# EAGLE design 5v-switch-sensor (EAGLE 7.2.0)
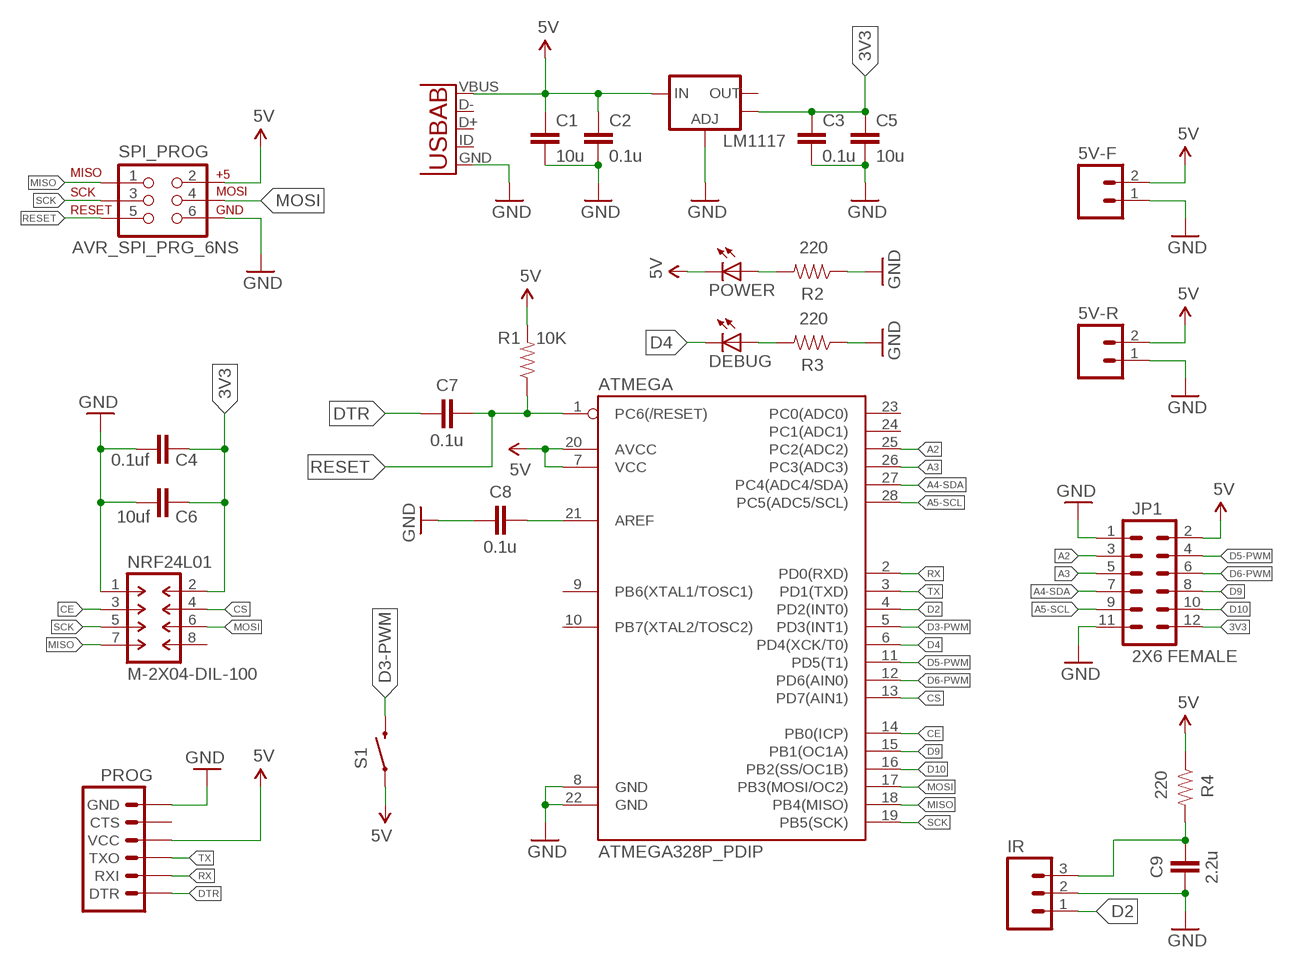
[diagram p0: schematic, sheet 1]

## Parts
5V-F  M02PTH  [1X02]
5V-R  M02PTH  [1X02]
ATMEGA  ATMEGA328P_PDIP  [DIL28-3]
C1  10u  CAP0805  [0805]
C2  0.1u  CAP0805  [0805]
C3  0.1u  CAP0805  [0805]
C4  0.1uf  CAP0805  [0805]
C5  10u  CAP0805  [0805]
C6  10uf  CAP0805  [0805]
C7  0.1u  CAP0805  [0805]
C8  0.1u  CAP0805  [0805]
C9  2.2u  CAP0805  [0805]
DEBUG  LEDCHIPLED_0805  [CHIPLED_0805]
IR  M03PTH  [1X03]
JP1  2X6 FEMALE  M06X2PTH_FEMALE  [2X6]
LM1117  V_REG_LM1117SOT223  [SOT223]
NRF24L01  M-2X04-DIL-100  [DIL-100-2X04]
POWER  LEDCHIPLED_0805  [CHIPLED_0805]
PROG  ARDUINO_SERIAL_PROGRAMPTH  [1X06]
R1  10K  RESISTOR0805-RES  [0805]
R2  220  RESISTOR0805-RES  [0805]
R3  220  RESISTOR0805-RES  [0805]
R4  220  RESISTOR0805-RES  [0805]
S1  SWITCH-MOMENTARY-2SMD-1101NE  [TACTILE-SWITCH-1101NE]
SPI_PROG  AVR_SPI_PRG_6NS  [2X3-NS]
U1  USB-AB  [USB-AB-MICRO-SMD]

## Nets
3V3: C3.1 C4.1 C5.1 C6.1 JP1.12 LM1117.4(OUT) NRF24L01.2
5V: 5V-F.2 5V-R.2 ATMEGA.7(VCC) ATMEGA.20(AVCC) C1.1 C2.1 JP1.2 LM1117.3(IN) POWER.C PROG.4(VCC) R1.2 R4.1 S1.1 SPI_PROG.2 U1.VBUS
A2: ATMEGA.25(PC2(ADC2)) JP1.3
A3: ATMEGA.26(PC3(ADC3)) JP1.5
A4-SDA: ATMEGA.27(PC4(ADC4/SDA)) JP1.7
A5-SCL: ATMEGA.28(PC5(ADC5/SCL)) JP1.9
CE: ATMEGA.14(PB0(ICP)) NRF24L01.3
CS: ATMEGA.13(PD7(AIN1)) NRF24L01.4
D2: ATMEGA.4(PD2(INT0)) IR.1
D3-PWM: ATMEGA.5(PD3(INT1)) S1.2
D4: ATMEGA.6(PD4(XCK/T0)) DEBUG.C
D5-PWM: ATMEGA.11(PD5(T1)) JP1.4
D6-PWM: ATMEGA.12(PD6(AIN0)) JP1.6
D9: ATMEGA.15(PB1(OC1A)) JP1.8
D10: ATMEGA.16(PB2(SS/OC1B)) JP1.10
DTR: C7.1 PROG.1(DTR)
GND: 5V-F.1 5V-R.1 ATMEGA.8(GND) ATMEGA.22(GND) C1.2 C2.2 C3.2 C4.2 C5.2 C6.2 C8.1 C9.1 IR.2 JP1.1 JP1.11 LM1117.1(ADJ) NRF24L01.1 PROG.6(GND) R2.1 R3.1 SPI_PROG.6 U1.GND
MISO: ATMEGA.18(PB4(MISO)) NRF24L01.7 SPI_PROG.1
MOSI: ATMEGA.17(PB3(MOSI/OC2)) NRF24L01.6 SPI_PROG.4
N$1: C9.2 IR.3 R4.2
N$2: POWER.A R2.2
N$3: ATMEGA.21(AREF) C8.2
N$4: DEBUG.A R3.2
RESET: ATMEGA.1(PC6(/RESET)) C7.2 R1.1 SPI_PROG.5
RX: ATMEGA.2(PD0(RXD)) PROG.2(RXI)
SCK: ATMEGA.19(PB5(SCK)) NRF24L01.5 SPI_PROG.3
TX: ATMEGA.3(PD1(TXD)) PROG.3(TXO)
Unconnected: ATMEGA.9(PB6(XTAL1/TOSC1)) ATMEGA.10(PB7(XTAL2/TOSC2)) ATMEGA.23(PC0(ADC0)) ATMEGA.24(PC1(ADC1)) LM1117.2(OUT) NRF24L01.8 PROG.5(CTS) U1.D+ U1.D- U1.ID(USBID)

## Library data of the parts
5V-F 5V-R = SparkFun-Connectors:M02: Standard 2-pin 0.1" header. Use with - straight break away headers ( PRT-00116) - right angle break away headers (PRT-00553) - swiss pins (PRT-00743) - machine pins (PRT-00117) - female headers (PRT-00115) Molex polarized connector foot print use with: PRT-08233 with associated crimp pins and housings. 2.54_SCREWTERM for use with PRT-10571. 3.5mm Screw Terminal footprints for PRT-08084 5mm Screw Terminal footprints for use with PRT-08432
ATMEGA = SparkFun-DigitalIC:ATMEGA328P_PDIP: uC used in the Arduino 32kb flash, 1k EEPROM, 2k SRAM This is the through-hole version of this chip.
C1-C9 = SparkFun-Capacitors:CAP: Capacitor Standard 0603 ceramic capacitor, and 0.1" leaded capacitor.
DEBUG POWER = adafruit:LED: LED OSRAM: - CHIPLED LG R971, LG N971, LY N971, LG Q971, LY Q971, LO R971, LY R971 LH N974, LH R974 LS Q976, LO Q976, LY Q976 LO Q996 - Hyper CHIPLED LW Q18S LB Q993, LB Q99A, LB R99A - SideLED LS A670, LO A670, LY A670, LG A670, LP A670 LB A673, LV A673, LT A673, LW A673 LH A674 LY A675 LS A676, LA A676, LO A676, LY A676, LW A676 LS A679, LY A679, LG A679 - Hyper Micro SIDELED® LS Y876, LA Y876, LO Y876, LY Y876 LT Y87S - SmartLED LW L88C, LW L88S LB L89C, LB L89S, LG L890 LS L89K, LO L89K, LY L89K LS L896, LA L896, LO L896, LY L896 - TOPLED LS T670, LO T670, LY T670, LG T670, LP T670 LSG T670, LSP T670, LSY T670, LOP T670, LYG T670 LG T671, LOG T671, LSG T671 LB T673, LV T673, LT T673, LW T673 LH T674 LS T676, LA T676, LO T676, LY T676, LB T676, LH T676, LSB T676, LW T676 LB T67C, LV T67C, LT T67C, LS T67K, LO T67K, LY T67K, LW E67C LS E67B, LA E67B, LO E67B, LY E67B, LB E67C, LV E67C, LT E67C LW T67C LS T679, LY T679, LG T679 LS T770, LO T770, LY T770, LG T770, LP T770 LB T773, LV T773, LT T773, LW T773 LH T774 LS E675, LA E675, LY E675, LS T675 LS T776, LA T776, LO T776, LY T776, LB T776 LHGB T686 LT T68C, LB T68C - Hyper Mini TOPLED® LB M676 - Mini TOPLED Santana® LG M470 LS M47K, LO M47K, LY M47K Source: http://www.osram.convergy.de/
IR = SparkFun-Connectors:M03: Header 3 Standard 3-pin 0.1" header. Use with straight break away headers (SKU : PRT-00116), right angle break away headers (PRT-00553), swiss pins (PRT-00743), machine pins (PRT-00117), and female headers (PRT-00115). Molex polarized connector foot print use with SKU : PRT-08232 with associated crimp pins and housings.
JP1 = SparkFun-Connectors:M06X2; PROD_ID: CONN-12423
LM1117 = SparkFun-PowerIC:V_REG_LM1117: Voltage Regulator LM1117 Standard adjustable voltage regulator but in SMD form. Spark Fun Electronics SKU : COM-00595; PROD_ID: VREG-08170
NRF24L01 = con-headers-jp:M-2X04-: MALE HEADER
PROG = SparkFun-Connectors:ARDUINO_SERIAL_PROGRAM: FTDI connector footprints
R1-R4 = SparkFun-Resistors:RESISTOR: Resistor Basic schematic elements and footprints for 0603, 1206, and PTH resistors.
S1 = SparkFun-Electromechanical:SWITCH-MOMENTARY-2: Various NO switches- pushbuttons, reed, etc; PROD_ID: SWCH-00815
SPI_PROG = SparkFun-Connectors:AVR_SPI_PRG_6: AVR ISP 6 Pin This is the reduced ISP connector for AVR programming. Common on Arduino. This footprint will take up less PCB space and can be used with a 10-pin to 6-pin adapter such as SKU: BOB-08508 **Special note about "TEST_POINT" package. The stop mask is on the top side, so if you want your programming test points to be on the bottom of your board, make sure to place this package on the bottom side of the board. This also ensure that the orientation to program from the bottom side will be correct.
U1 = SparkFun-Connectors:USB-AB: This is a USB AB connector that is compatible with USB OTG. i.e. this connector can serve as a host or device

## Board
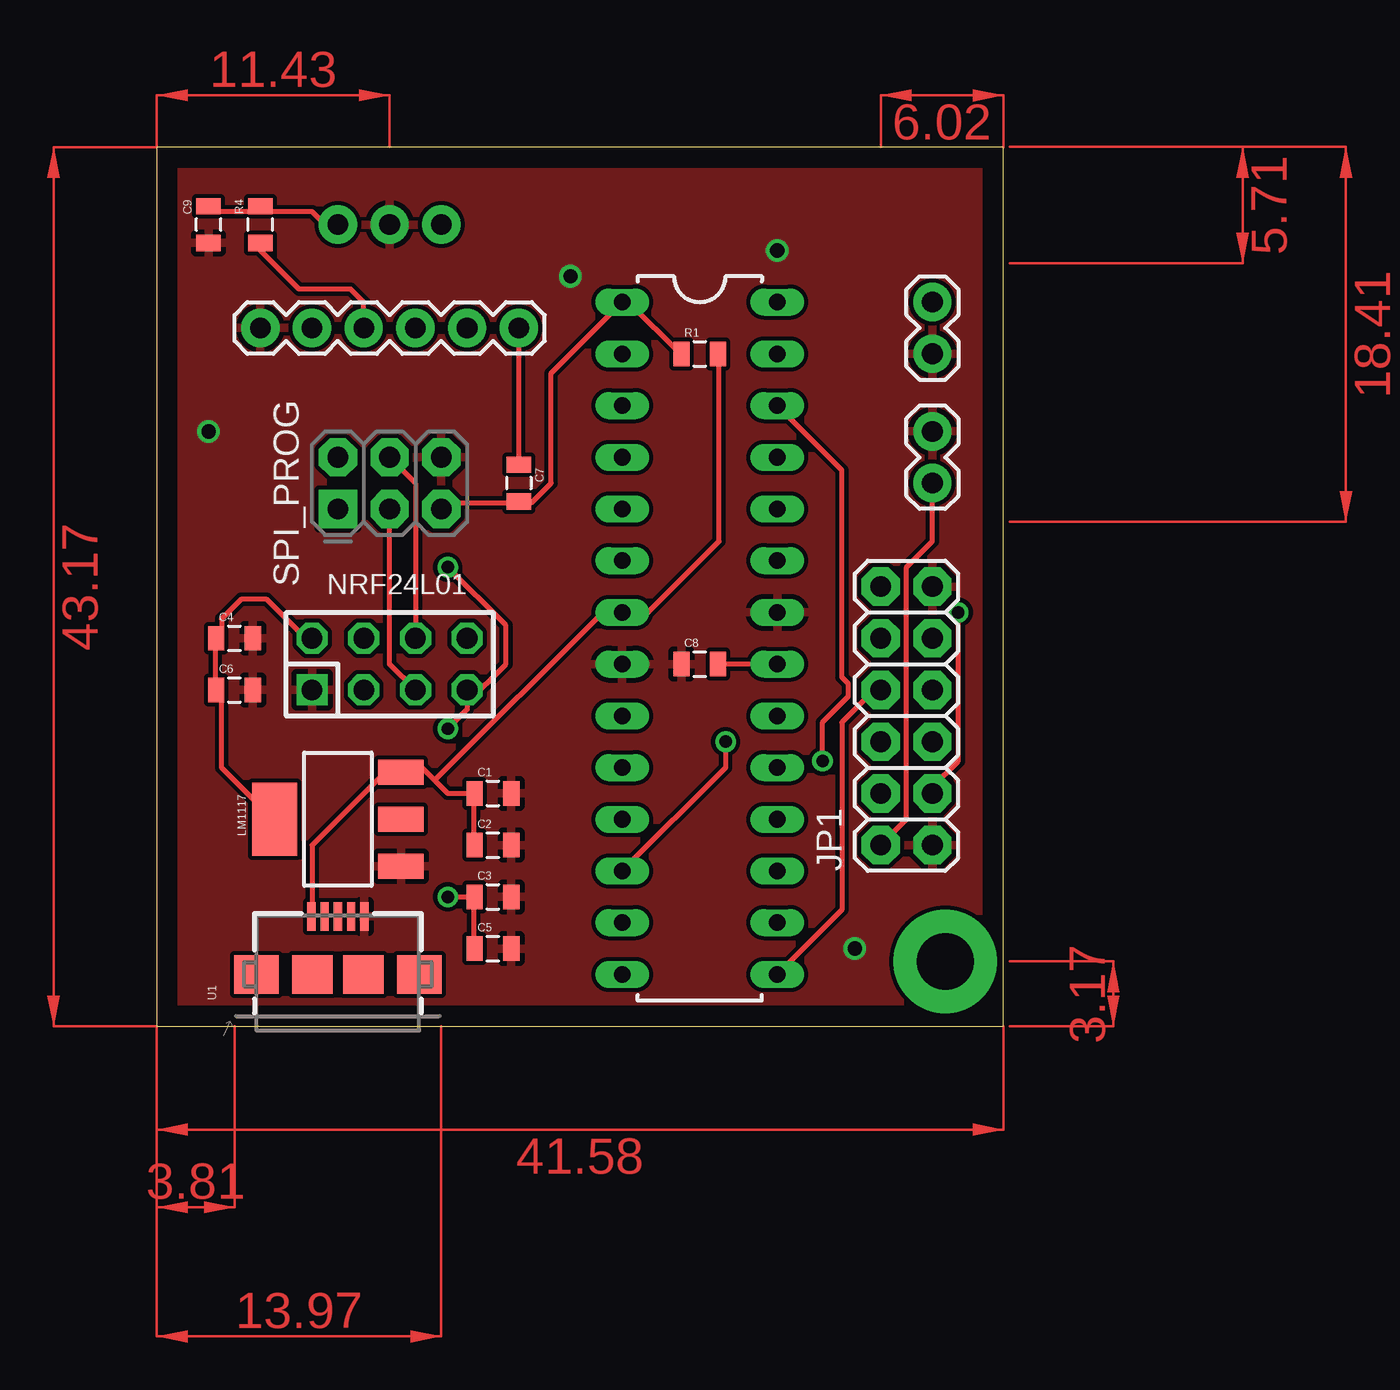
[diagram p1: board, top side]
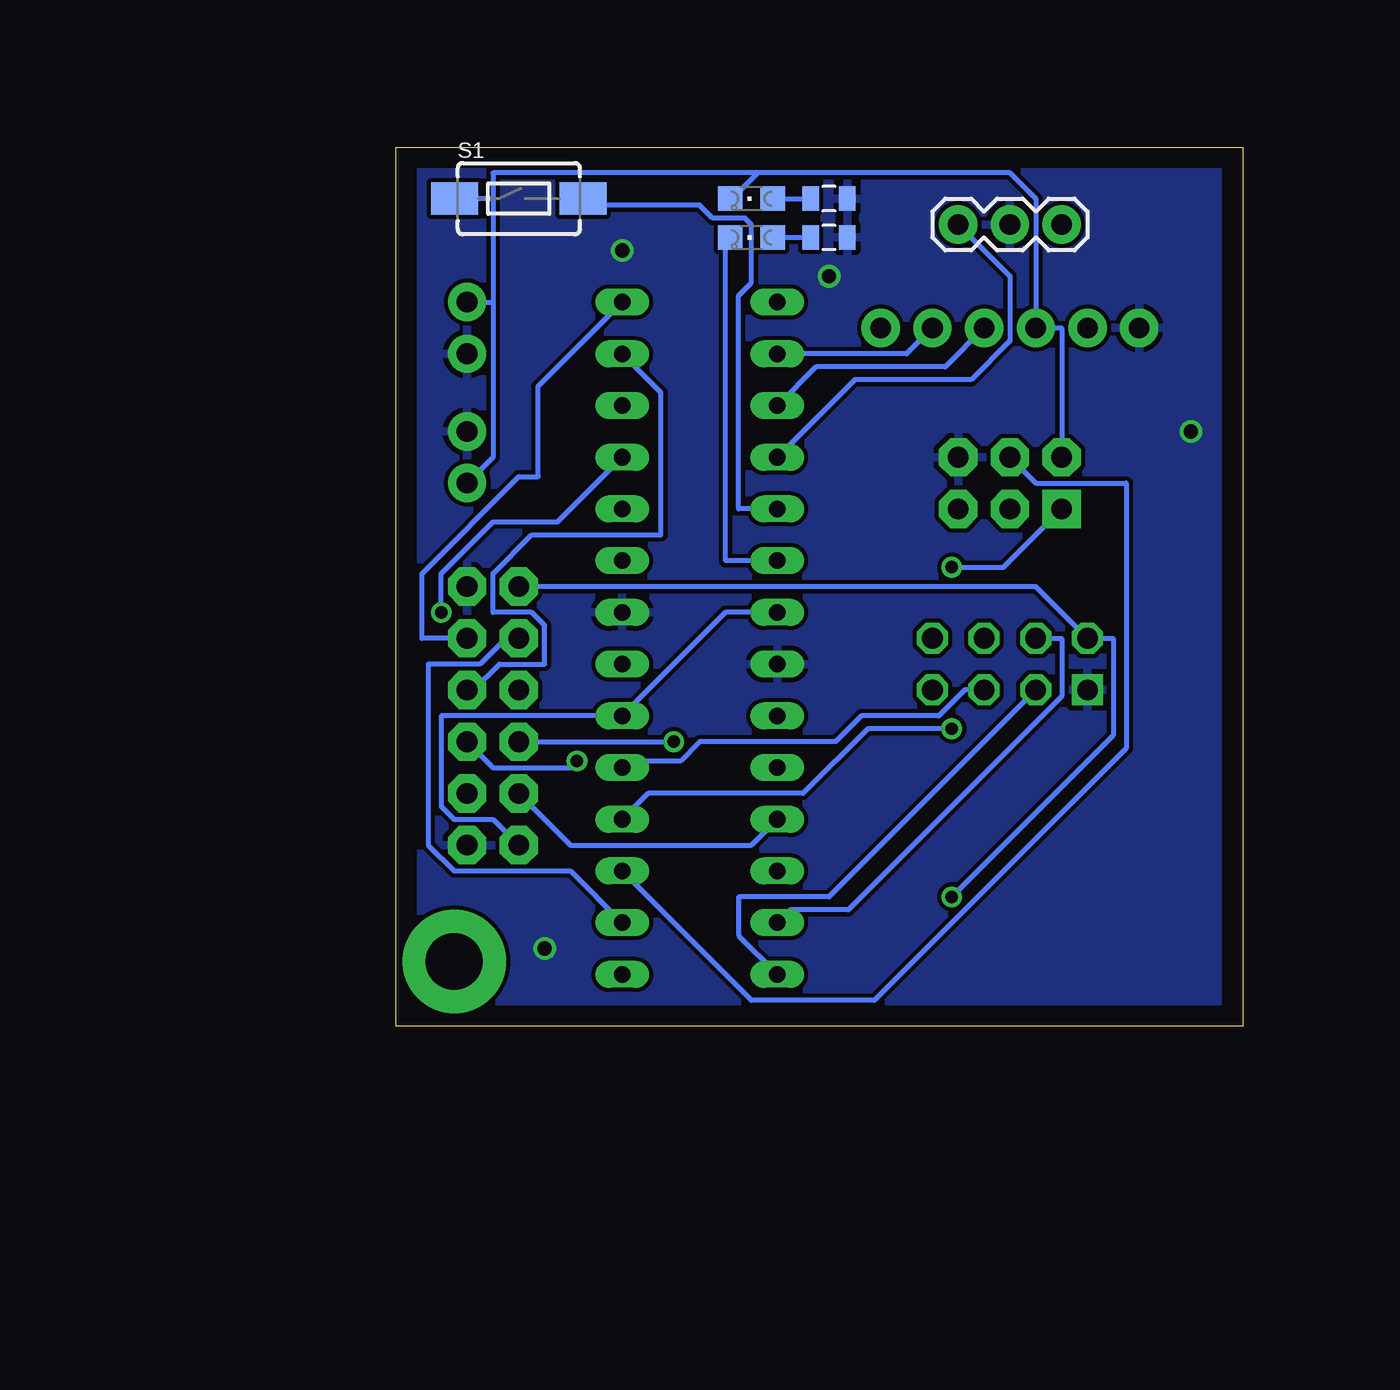
[diagram p2: board, bottom side, seen from below]

Size 41.58 x 43.17 mm. Coordinates in mm from the lower left corner, seen from the top.
Outline: 0,0 41.58,0 41.58,43.17 0,43.17 0,0
Copper layers (1*16): Top 0.035mm / dielectric 1.5mm / Bottom 0.035mm
Design rules "default": minimum track width 10mil, minimum drill 24mil, track to track 8mil, track to pad 8mil, pad to pad 8mil, via to via 8mil, smd to smd 8mil, copper to edge 40mil, drill to drill 8mil, minimum pad ring 10mil, minimum via ring 8mil, stop-mask expansion 4mil, vias tented up to drill 0mil, thermal gap 10mil

### Footprints (pad centres in the part's own frame; a part is rotated, then mirrored left to right if it is on the bottom)
1X02 = drill 1.016 pad 1.88: 1 0,0; 2 2.54,0
DIL28-3 = drill 0.813 long: 1 -16.51,-3.81; 2 -13.97,-3.81; 3 -11.43,-3.81; 4 -8.89,-3.81; 5 -6.35,-3.81; 6 -3.81,-3.81; 7 -1.27,-3.81; 8 1.27,-3.81; 9 3.81,-3.81; 10 6.35,-3.81; 11 8.89,-3.81; 12 11.43,-3.81; 13 13.97,-3.81; 14 16.51,-3.81; 15 16.51,3.81; 16 13.97,3.81; 17 11.43,3.81; 18 8.89,3.81; 19 6.35,3.81; 20 3.81,3.81; 21 1.27,3.81; 22 -1.27,3.81; 23 -3.81,3.81; 24 -6.35,3.81; 25 -8.89,3.81; 26 -11.43,3.81; 27 -13.97,3.81; 28 -16.51,3.81
0805 = smd 0.8 x 1.2: 1 -0.9,0; 2 0.9,0
CHIPLED_0805 = smd 1.2 x 1.2: A 0,-1.05; C 0,1.05
1X03 = drill 1.016 pad 1.88: 1 0,0; 2 2.54,0; 3 5.08,0
2X6 = drill 1.016 pad 1.88 octagon: 1 0,0; 2 0,2.54; 3 2.54,0; 4 2.54,2.54; 5 5.08,0; 6 5.08,2.54; 7 7.62,0; 8 7.62,2.54; 9 10.16,0; 10 10.16,2.54; 11 12.7,0; 12 12.7,2.54
SOT223 = smd 1.219 x 2.235: 1 -2.311,-3.099; 2 0,-3.099; 3 2.311,-3.099 | smd 3.6 x 2.2: 4 0,3.099
DIL-100-2X04 = drill 1.016 square: 1 -3.81,-1.27 | drill 1.016 octagon: 2 -3.81,1.27; 3 -1.27,-1.27; 4 -1.27,1.27; 5 1.27,-1.27; 6 1.27,1.27; 7 3.81,-1.27; 8 3.81,1.27
1X06 = drill 1.016 pad 1.88: 1 0,0; 2 2.54,0; 3 5.08,0; 4 7.62,0; 5 10.16,0; 6 12.7,0
TACTILE-SWITCH-1101NE = smd 2.3 x 1.6: 1 -3.15,0; 2 3.15,0
2X3-NS = drill 1.016 pad 1.88 square: 1 -2.54,-1.27 | drill 1.016 pad 1.88 octagon: 2 -2.54,1.27; 3 0,-1.27; 4 0,1.27; 5 2.54,-1.27; 6 2.54,1.27
USB-AB-MICRO-SMD = smd 1.4 x 0.4: D+ 2.85,0; D- 2.85,0.65; GND 2.85,-1.3; ID 2.85,-0.65; VBUS 2.85,1.3 | smd 1.9 x 2: P$6 0,1.25; P$7 0,-1.25 | smd 1.9 x 2.2: P$8 0,4; P$9 0,-4

### Placement (x,y rotation side)
5V-F  38.1,33.02 90 top
5V-R  38.1,29.21 270 top
ATMEGA  26.67,19.05 270 top
C1  16.51,11.43 0 top
C2  16.51,8.89 0 top
C3  16.51,6.35 0 top
C4  3.81,19.05 0 top
C5  16.51,3.81 0 top
C6  3.81,16.51 0 top
C7  17.78,26.67 270 top
C8  26.67,17.78 0 top
C9  2.54,39.37 90 top
DEBUG  24.13,38.74 90 bottom
IR  13.97,39.37 0 bottom
JP1  38.1,8.89 90 top
LM1117  8.89,10.16 90 top
NRF24L01  11.43,17.78 0 top
POWER  24.13,40.64 90 bottom
PROG  17.78,34.29 180 top
R1  26.67,33.02 0 top
R2  20.32,40.64 180 bottom
R3  20.32,38.74 180 bottom
R4  5.08,39.37 90 top
S1  35.56,40.64 0 bottom
SPI_PROG  11.43,26.67 0 top
U1  8.89,2.54 90 top

### Tracks (layer width: path | path; a pad name or v marks a point on that pad's centre or on a via)
3V3  (via drill 0.61)
  Top 0.254: LM1117.4 5.71,10.16 3.17,12.7 3.17,16.51 C6.1 2.86,16.51 2.86,19.05 C4.1 3.17,19.05 3.17,20 4.13,20.95 5.4,20.95 7.3,19.05 NRF24L01.2 | 15.56,6.35 15.56,3.81 C5.1 | v14.29,6.35 15.56,6.35 | 15.56,6.35 C3.1
  Bottom 0.254: v14.29,6.35 6.35,14.29 6.35,19.05 NRF24L01.2 10.16,21.59 JP1.12
5V
  Top 0.254: 15.56,11.43 15.56,8.89 C2.1 | U1.VBUS 7.62,5.4 7.62,8.89 11.11,12.38 11.75,12.38 LM1117.3 12.06,12.7 13.02,12.7 13.65,12.06 | 15.56,11.43 14.29,11.43 13.65,12.06 | 15.56,11.43 C1.1 | R1.2 27.62,33.02 27.62,23.81 24.13,20.32 ATMEGA.7 21.91,20.32 13.65,12.06 | 5V-R.2 38.1,23.81 36.83,22.54 36.83,10.16 JP1.2 | PROG.4 10.16,35.56 9.52,36.2 6.98,36.2 5.08,38.1 R4.1
  Bottom 0.254: 5V-R.2 36.83,27.94 36.83,35.56 | 5V-F.2 36.83,35.56 | SPI_PROG.2 8.89,34.29 PROG.4 10.16,40.64 11.43,41.91 23.81,41.91 | 23.81,41.91 25.08,40.64 POWER.C | 36.83,40.64 36.83,41.91 23.81,41.91 | 36.83,40.64 36.83,35.56 | ATMEGA.7 25.4,20.32 ATMEGA.20 39.37,15.24 39.37,10.79 38.73,10.16 36.83,10.16 JP1.2 | 36.83,40.64 S1.1
A2  (via drill 0.61)
  Top 0.254: v39.37,20.32 39.37,13.02 38.1,11.75 JP1.3
  Bottom 0.254: ATMEGA.25 33.66,24.77 36.83,24.77 39.37,22.22 v39.37,20.32
A3  (via drill 0.61)
  Top 0.254: ATMEGA.26 33.66,27.3 33.66,17.14 33.97,16.83 33.97,16.19 32.7,14.92 v32.7,13.02
  Bottom 0.254: v32.7,13.02 33.02,12.7 36.83,12.7 JP1.5
A4-SDA
  Bottom 0.254: ATMEGA.27 28.57,31.11 28.57,24.13 34.92,24.13 36.83,22.22 36.83,20.32 34.92,20.32 34.29,19.68 34.29,17.78 36.51,17.78 37.78,16.51 JP1.7
A5-SCL
  Bottom 0.254: ATMEGA.28 34.61,31.43 34.61,26.99 35.56,26.99 40.32,22.22 40.32,19.05 JP1.9
CE
  Bottom 0.254: ATMEGA.14 24.77,4.45 24.77,6.35 20.32,6.35 NRF24L01.3
CS
  Bottom 0.254: ATMEGA.13 22.23,5.71 19.37,5.71 8.89,16.19 8.89,19.05 NRF24L01.4
D2
  Bottom 0.254: ATMEGA.4 19.05,31.75 13.33,31.75 11.43,33.66 11.43,36.83 IR.1
D3-PWM
  Bottom 0.254: ATMEGA.5 24.77,25.4 24.77,35.88 24.13,36.51 24.13,39.37 24.45,39.69 26.03,39.69 26.67,40.32 32.07,40.32 32.38,40.64 S1.2
D4
  Bottom 0.254: ATMEGA.6 25.4,22.86 25.4,38.74 DEBUG.C
D5-PWM
  Bottom 0.254: ATMEGA.11 24.13,8.89 33.02,8.89 JP1.4
D6-PWM  (via drill 0.61)
  Top 0.254: ATMEGA.12 27.94,12.7 v27.94,13.97
  Bottom 0.254: JP1.6 v27.94,13.97
D9
  Top 0.254: ATMEGA.15 33.66,5.71 33.66,14.92 35.24,16.51 JP1.8
D10
  Bottom 0.254: ATMEGA.16 33.02,7.62 38.73,7.62 40,8.89 40,17.78 37.46,17.78 36.2,19.05 JP1.10
DTR
  Top 0.254: PROG.1 C7.1
GND  (via drill 0.7)
  other vias: 20.32,36.83 30.48,38.1 2.54,29.21 34.29,3.81
  pour Bottom: -1.27,44.45 43.18,44.45 43.18,-1.27 -1.27,-1.27
  pour Top: 0,43.18 41.91,43.18 41.91,0 0,0
MISO  (via drill 0.61)
  Top 0.254: v14.29,14.61 15.24,15.56 15.24,15.88 | v14.29,22.54 17.14,19.68 17.14,17.78 15.24,15.88 | 15.24,15.88 NRF24L01.7
  Bottom 0.254: ATMEGA.18 29.21,11.43 21.59,11.43 18.41,14.61 v14.29,14.61 | SPI_PROG.1 11.75,22.54 v14.29,22.54
MOSI
  Top 0.254: NRF24L01.6 12.7,26.67 SPI_PROG.4
  Bottom 0.254: ATMEGA.17 24.13,1.27 18.1,1.27 5.71,13.65 5.71,26.67 10.16,26.67 SPI_PROG.4
N$1
  Top 0.254: 5.08,40.01 2.54,40.01 C9.2 | 5.08,40.01 7.62,40.01 8.25,39.37 IR.3 | 5.08,40.01 R4.2
N$2
  Bottom 0.254: POWER.A R2.2
N$3
  Top 0.254: ATMEGA.21 C8.2
N$4
  Bottom 0.254: DEBUG.A R3.2
N$6  (via drill 2.79 pad 5.08)
  other vias: 38.73,3.17
RESET
  Top 0.254: R1.1 25.72,33.02 23.18,35.56 ATMEGA.1 19.37,32.07 19.37,26.67 18.41,25.72 17.78,25.72 | 17.78,25.72 14.29,25.72 SPI_PROG.5 | 17.78,25.72 C7.2
RX
  Bottom 0.254: ATMEGA.2 16.51,33.02 PROG.2
SCK
  Top 0.254: SPI_PROG.3 11.43,17.78 NRF24L01.5
  Bottom 0.254: ATMEGA.19 30.16,13.02 27.62,13.02 26.67,13.97 20,13.97 18.73,15.24 14.92,15.24 13.65,16.51 NRF24L01.5
TX
  Bottom 0.254: ATMEGA.3 20.95,32.38 14.6,32.38 PROG.3
(copper drawn outside any net)
  shapes: Top area x9